# EasyEDA Pro project psu-5v-v101.eprj, board bus-board
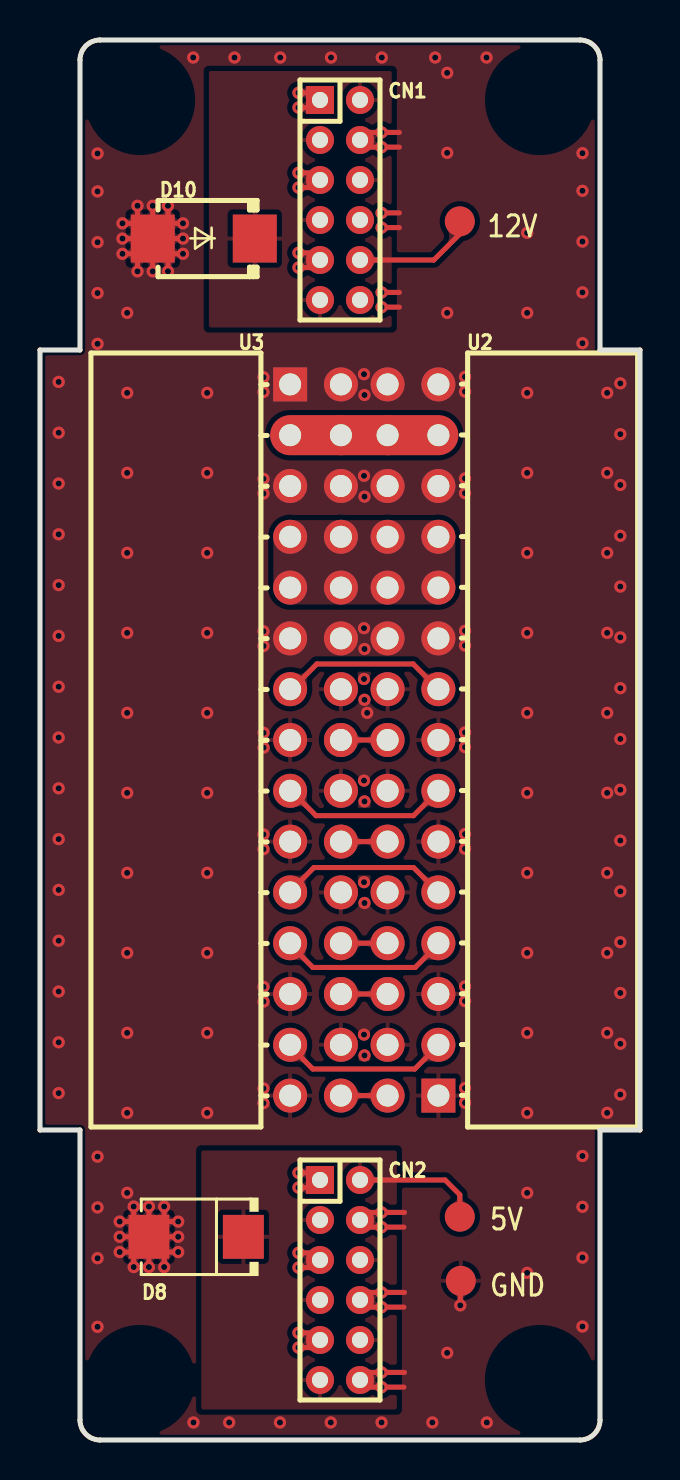
[diagram p3: board, top side]
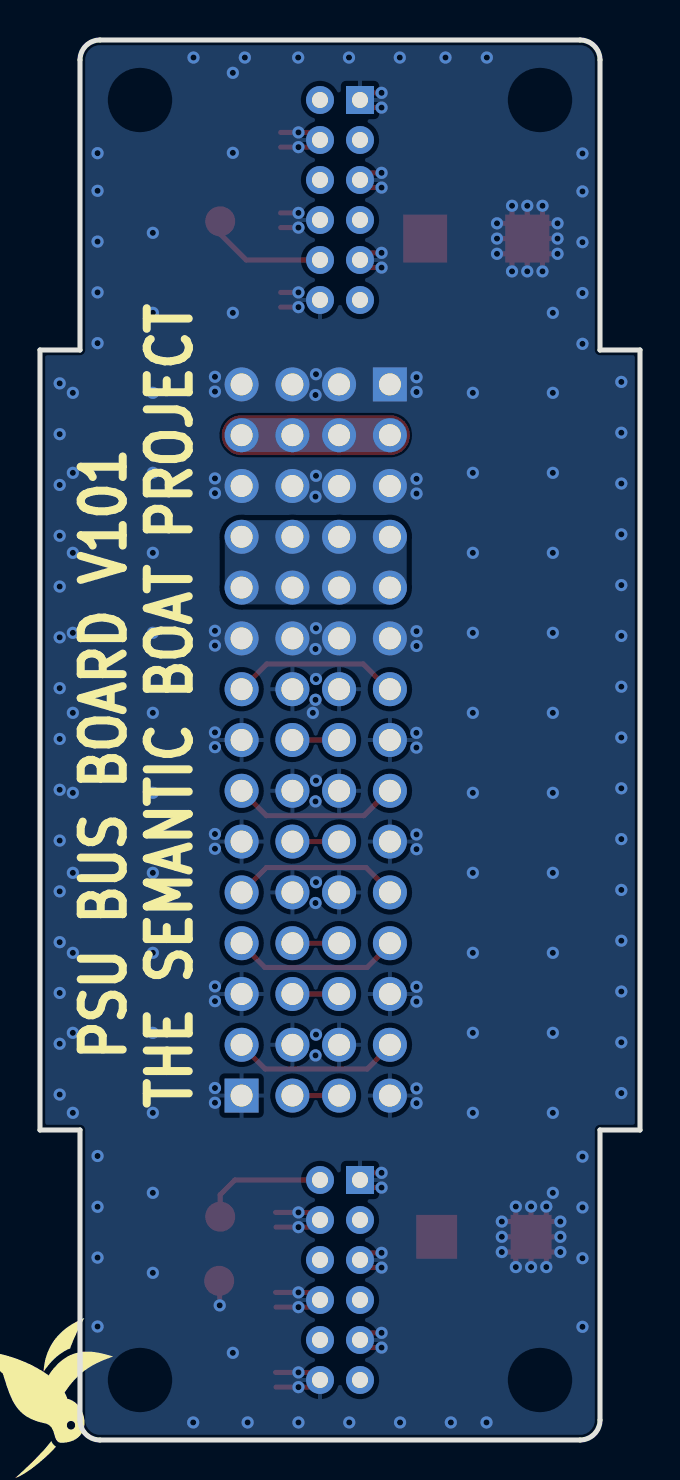
[diagram p4: board, bottom side, seen from below]

Outline 30 x 70 mm; copper layers: Top Layer, Inner1, Inner2, Bottom Layer. Coordinates in mm from the lower left corner of the outline.
Outline path: 0,54.5 2,54.5 2,69 arc(2.29,69.71) 3,70 27,70 arc(27.71,69.71) 28,69 28,54.5 30,54.5 30,15.5 28,15.5 28,1 arc(27.71,0.29) 27,0 3,0 arc(2.29,0.29) 2,1 2,15.5 0,15.5 0,54.5
Stack: Top Layer 0.035mm Outer layer thickness 1oz / Dielectric1 0.2104mm 7628 RC49% 8.6mil / Inner1 0.0152mm Inner layer thickness / Dielectric2 1.065mm 1.1mm H/HOZ Copper / Inner2 0.0152mm Inner layer thickness / Dielectric3 0.2104mm 7628 RC49% 8.6mil / Bottom Layer 0.035mm Outer layer thickness 1oz

## Design rules (mm)
net GND: power
net +5V: power
net +12V: power
template: JLCPCB Capability(Multiple Layers Board)
spacing copperThickness1oz (default): track to track 0.102, other pairs 0.152 to 0.3
spacing copperThickness2oz: track to track 0.203, other pairs 0.152 to 0.3
spacing copperThicknessInner0.5oz: track to track 0.089, other pairs 0.152 to 0.3
track width copperThickness1oz (default): min 0.102, default 0.254, max 2.54
track width copperThickness2oz: min 0.203, default 0.254, max 2.54
track width copperThickness0.5oz: min 0.089, default 0.254, max 2.54
differential pair differentialPair (default): width min 0.127, default 0.254, max 2.54; gap min 0.152, default 0.152
via viaSize (default): diameter min 0.3, default 0.61, max 10; hole min 0.2, default 0.305, max 6.3

## Placement (name value [footprint] x y rotation side)
CN1  PH2.0-01-06PZS  [HDR-TH_12P-P2.00-V-M-R2-C6-S2.00]  15 62 270 top
CN2  PH2.0-01-06PZS  [HDR-TH_12P-P2.00-V-M-R2-C6-S2.00]  15 8 270 top
D8  SMBJ5.0A  [SMB_L4.6-W3.6-LS5.3-RD]  7.81 10.16 180 top
D10  P6SMB20A  [SMB_L4.5-W3.6-LS5.4-RD]  8.19 60.07 180 top
TP1  -  [Test-Point-0.5mm]  21.04 7.96 0 top
TP2  -  [Test-Point-0.5mm]  20.99 60.93 0 top
TP3  -  [Test-Point-0.5mm]  20.99 11.16 0 top
U2  PM254-2-15-W-8.5  [HDR-TH_30P-P2.54-H-F-R2-C15-W8.5]  18.65 35 90 top
U3  PM254-2-15-W-8.5  [HDR-TH_30P-P2.54-H-F-R2-C15-W8.5]  13.78 35 270 top

## Footprints (pads in the part's own frame, mm; a bottom-side part is the same pattern mirrored in y, then rotated)
HDR-TH_12P-P2.00-V-M-R2-C6-S2.00
  rect 1.4x1.4 hole 0.8: 1(-5,-1)
  round 1.4 hole 0.8: 2(-5,1) 3(-3,-1) 4(-3,1) 5(-1,-1) 6(-1,1) 7(1,-1) 8(1,1) 9(3,-1) 10(3,1) 11(5,-1) 12(5,1)
HDR-TH_30P-P2.54-H-F-R2-C15-W8.5
  rect 1.7x1.7 hole 1.1: 1(-17.78,-1.27)
  round 1.7 hole 1.1: 2(-17.78,1.27) 3(-15.24,-1.27) 4(-15.24,1.27) 5(-12.7,-1.27) 6(-12.7,1.27) 7(-10.16,-1.27) 8(-10.16,1.27) 9(-7.62,-1.27) 10(-7.62,1.27) 11(-5.08,-1.27) 12(-5.08,1.27) 13(-2.54,-1.27) 14(-2.54,1.27) 15(0,-1.27) 16(0,1.27) 17(2.54,-1.27) 18(2.54,1.27) 19(5.08,-1.27) 20(5.08,1.27) 21(7.62,-1.27) 22(7.62,1.27) 23(10.16,-1.27) 24(10.16,1.27) 25(12.7,-1.27) 26(12.7,1.27) 27(15.24,-1.27) 28(15.24,1.27) 29(17.78,-1.27) 30(17.78,1.27)
SMB_L4.5-W3.6-LS5.4-RD
  rect 2.2x2.4 smd: 1(-2.551,0) 2(2.551,0)
SMB_L4.6-W3.6-LS5.3-RD
  rect 2.047x2.192 smd: 1(-2.361,0) 2(2.361,0)
Test-Point-0.5mm
  round 1.5 smd: 1(0,0)

## Nets
As in the schematic.

## Via types
v1: diameter 0.61, hole 0.305, Top Layer to Bottom Layer, 204 vias

## Routing (per net, layer and track width the routed paths; a pad name or vN(x,y) marks a point on that pad's centre or on a via; arc(x,y) is an arc through that point)
+5V: length 6.4
  Top Layer w0.254: CN2.2 20.25,13 20.99,12.26 TP3.1
+12V: length 13.6
  Top Layer w0.254: TP2.1 20.99,60.3 19.69,59 CN1.10
  Top Layer w2: U3.3 U3.4 U2.28 U2.27
GND: length 64.7
  Top Layer w0.254: v1(4.88,58.43) 4.88,59.31 ; 4.88,59.31 D10.2 ; 4.88,59.31 v1(4.12,59.31) ; v1(12.92,59.36) 13.64,59.36 CN1.9 13.62,58.62 v1(12.92,58.62) ; 18.22,3.38 v1(17.08,3.38) 16.38,3.38 CN2.12 16.36,2.64 v1(17.08,2.64) 18.19,2.64 ; 18.19,10.64 v1(17.08,10.64) 16.36,10.64 CN2.4 16.38,11.38 v1(17.08,11.38) 18.22,11.38 ; v1(4.12,60.07) D10.2 ; D10.2 v1(5.64,61.71) ; D10.2 v1(5.64,58.43) ; D10.2 v1(7.15,60.07) ; v1(3.98,10.92) 4.68,10.92 v1(4.68,11.67) ; v1(4.12,60.83) 4.88,60.83 v1(4.88,61.71) ; v1(6.91,10.92) 6.21,10.92 v1(6.21,11.67) ; v1(12.92,8.62) 13.62,8.62 CN2.5 13.64,9.36 v1(12.92,9.36) ; v1(4.68,8.65) 4.68,9.4 v1(3.98,9.4) ; v1(3.98,10.16) D8.2 ; D8.2 v1(6.91,10.16) ; D8.2 v1(5.45,8.65) ; D8.2 6.21,9.4 ; D8.2 v1(5.45,11.67) ; v1(6.4,61.71) 6.4,60.83 v1(7.15,60.83) ; 17.08,61.36 17.97,61.36 ; v1(6.4,58.43) 6.4,59.31 v1(7.15,59.31) ; v1(17.08,56.64) 17.97,56.64 ; v1(12.92,4.62) 13.62,4.62 CN2.9 13.64,5.36 v1(12.92,5.36) ; 17.97,65.38 v1(17.08,65.38) 16.38,65.38 CN1.4 16.36,64.64 v1(17.08,64.64) 17.97,64.64 ; 18.22,7.38 v1(17.08,7.38) 16.38,7.38 CN2.8 16.36,6.64 v1(17.08,6.64) 18.19,6.64 ; v1(17.08,57.38) 17.97,57.38 ; TP1.1 21.01,7.93 v1(21.01,6.73) ; v1(6.21,8.65) 6.21,9.4 ; 6.21,9.4 v1(6.91,9.4) ; v1(17.08,60.62) 17.97,60.62 ; v1(12.92,67.36) 13.64,67.36 CN1.1 13.62,66.62 v1(12.92,66.62) ; v1(12.92,62.62) 13.62,62.62 CN1.5 13.64,63.36 v1(12.92,63.36) ; v1(12.92,12.62) 13.62,12.62 CN2.1 13.64,13.36 v1(12.92,13.36)
  vias: v1(0.93,52.9) v1(0.93,50.36) v1(0.93,47.82) v1(0.93,45.28) v1(0.93,42.74) v1(0.93,40.2) v1(0.93,37.66) v1(0.93,35.12) v1(0.93,32.58) v1(0.93,30.04) v1(0.93,27.5) v1(0.93,24.96) v1(0.93,22.42) v1(0.93,19.88) v1(0.93,17.34) v1(2.88,64.33) v1(2.88,62.43) v1(2.88,59.89) v1(2.88,57.35) v1(2.88,54.81) v1(2.88,14.17) v1(2.88,11.63) v1(2.88,9.09) v1(2.88,5.66) v1(4.36,56.36) v1(4.36,52.36) v1(4.36,48.36) v1(4.36,44.36) v1(4.36,40.36) v1(4.36,36.36) v1(4.36,32.36) v1(4.36,28.36) v1(4.36,24.36) v1(4.36,20.36) v1(4.36,16.36) v1(4.36,12.36) v1(7.66,69.12) v1(7.67,0.88) v1(8.36,52.36) v1(8.36,48.36) v1(8.36,44.36) v1(8.36,40.36) v1(8.36,36.36) v1(8.36,32.36) v1(8.36,28.36) v1(8.36,24.36) v1(8.36,20.36) v1(8.36,16.36) v1(9.46,0.88) v1(9.72,69.12) v1(11.17,53.14) v1(11.17,52.4) v1(11.17,48.06) v1(11.17,47.32) v1(11.17,40.44) v1(11.17,39.7) v1(11.18,35.36) v1(11.18,34.62) v1(11.17,30.28) v1(11.17,29.54) v1(11.18,22.66) v1(11.18,21.92) v1(11.17,17.58) v1(11.17,16.84) v1(12.01,69.12) v1(12,0.88) v1(14.54,0.88) v1(14.55,69.12) v1(16.2,53.29) v1(16.22,52.25) v1(16.2,48.21) v1(16.22,47.17) v1(16.2,40.59) v1(16.22,39.55) v1(16.2,38.05) v1(16.22,37.01) v1(16.2,32.97) v1(16.22,31.93) v1(16.2,27.89) v1(16.22,26.85) v1(16.2,20.27) v1(16.22,19.23) v1(16.36,36.36) v1(17.09,69.12) v1(17.08,61.35) v1(17.08,0.88) v1(19.62,0.88) v1(19.76,69.12) v1(20.36,68.36) v1(20.36,64.36) v1(20.36,56.36) v1(20.36,4.36) v1(21.25,53.16) v1(21.25,52.42) v1(21.25,48.08) v1(21.25,47.34) v1(21.25,40.46) v1(21.25,39.72) v1(21.25,35.38) v1(21.25,34.64) v1(21.25,30.3) v1(21.25,29.56) v1(21.25,22.68) v1(21.25,21.94) v1(21.25,17.6) v1(21.25,16.86) v1(22.33,69.12) v1(22.34,0.88) v1(24.36,60.36) v1(24.36,56.36) v1(24.36,52.36) v1(24.36,48.36) v1(24.36,44.36) v1(24.36,40.36) v1(24.36,36.36) v1(24.36,32.36) v1(24.36,28.36) v1(24.36,24.36) v1(24.36,20.36) v1(24.36,16.36) v1(24.36,12.36) v1(24.36,8.36) v1(27.12,64.34) v1(27.12,62.46) v1(27.12,59.92) v1(27.12,57.38) v1(27.12,54.84) v1(27.12,14.2) v1(27.12,11.66) v1(27.12,9.12) v1(27.12,5.67) v1(28.36,52.36) v1(28.36,48.36) v1(28.36,44.36) v1(28.36,40.36) v1(28.36,36.36) v1(28.36,32.36) v1(28.36,28.36) v1(28.36,24.36) v1(28.36,20.36) v1(28.36,16.36) v1(29.02,52.83) v1(29.02,50.29) v1(29.02,47.75) v1(29.02,45.21) v1(29.02,42.67) v1(29.02,40.13) v1(29.02,37.59) v1(29.02,35.05) v1(29.02,32.51) v1(29.02,29.97) v1(29.02,27.43) v1(29.02,24.89) v1(29.02,22.35) v1(29.02,19.81) v1(29.02,17.27)
SB_RES0: length 2.3
  Top Layer w0.254: U3.24 U2.8
SB_RES1: length 8.5
  Top Layer w0.254: U2.9 18.68,28.62 13.7,28.62 12.45,27.38
SB_RES2: length 2.3
  Top Layer w0.254: U3.26 U2.6
SB_RES3: length 8.3
  Top Layer w0.254: 12.57,24.7 13.65,23.63 18.76,23.63 19.92,24.79 U2.7
SB_RES4: length 2.3
  Top Layer w0.254: U3.30 U2.2
SB_RES5: length 8.5
  Top Layer w0.254: 12.43,19.76 13.64,18.55 18.74,18.55 19.92,19.73 U2.3
SMBUS_ALERT: length 8.4
  Top Layer w0.254: U2.13 18.68,31.22 13.8,31.22 12.56,32.46
SMBUS_CLK: length 2.3
  Top Layer w0.254: U3.16 U2.16
SMBUS_DATA: length 2.3
  Top Layer w0.254: U3.20 U2.12
STACK_ENABLED: length 8.4
  Top Layer w0.254: 12.58,37.54 13.84,38.8 18.66,38.8 U2.17

## Copper pours and planes (outline as drawn; the poured copper is in the pictures)
+5V on Top Layer: 8.06,14.48 17.84,14.48 17.84,1.52 8.06,1.52
+5V on Top Layer: 11.67,45.99 20.76,45.99 20.76,41.78 11.67,41.78
+5V on Bottom Layer: 11.67,45.99 20.76,45.99 20.76,41.78 11.67,41.78
+5V on Inner1: -4.39,45.97 33.97,45.97 33.97,-3.3 -4.39,-3.3
+5V on Inner2: -4.39,45.97 33.97,45.97 33.97,-3.3 -4.39,-3.3
+12V on Top Layer: 8.44,68.45 17.59,68.45 17.59,55.63 8.44,55.63
+12V on Bottom Layer: 11.67,51.1 20.76,51.1 20.76,49.39 11.67,49.39
+12V on Inner1: -2.61,73.03 33.84,73.03 33.84,49.28 -2.61,49.28
+12V on Inner2: -2.61,73.03 33.84,73.03 33.84,49.28 -2.61,49.28
GND on Top Layer: -2.61,72.39 32.32,72.39 32.32,-1.91 -2.61,-1.91
GND on Bottom Layer: -2.61,72.14 31.68,72.14 31.68,-1.91 -2.61,-1.91

Small or netless copper shapes (teardrops, artwork), in the pictures only: 126 on Top Layer

## Text on the board
Bottom Silkscreen Layer: THE SEMANTIC BOAT PROJECT | PSU BUS BOARD V101
Top Silkscreen Layer: 12V | 5V | GND
